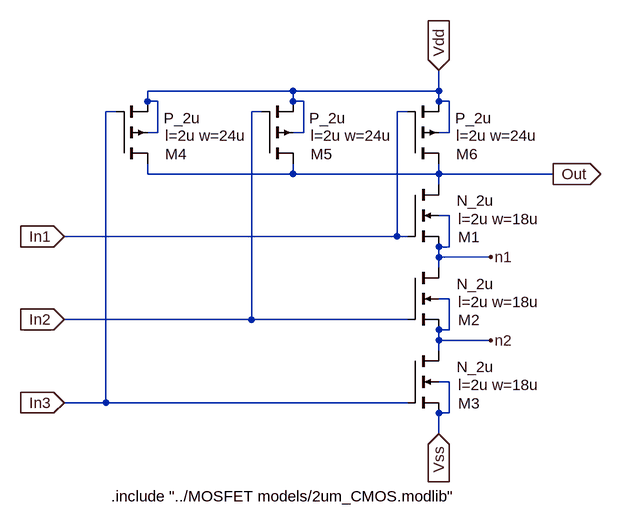
[diagram p0: schematic NAND3.asc]
NAND3.asc, the LTspice schematic file:
Version 4
SHEET 1 880 872
WIRE -32 48 -256 48
WIRE 192 48 192 16
WIRE 192 48 -32 48
WIRE -256 64 -256 48
WIRE -240 64 -256 64
WIRE -32 64 -32 48
WIRE -16 64 -32 64
WIRE 192 64 192 48
WIRE 208 64 192 64
WIRE -304 80 -320 80
WIRE -80 80 -96 80
WIRE 144 80 128 80
WIRE -240 112 -240 64
WIRE -240 112 -256 112
WIRE -16 112 -16 64
WIRE -16 112 -32 112
WIRE 208 112 208 64
WIRE 208 112 192 112
WIRE -256 176 -256 160
WIRE -32 176 -32 160
WIRE -32 176 -256 176
WIRE 192 176 192 160
WIRE 192 176 -32 176
WIRE 368 176 192 176
WIRE 192 192 192 176
WIRE 208 240 192 240
WIRE 128 272 128 80
WIRE 128 272 -384 272
WIRE 144 272 128 272
WIRE 208 288 208 240
WIRE 208 288 192 288
WIRE 192 304 192 288
WIRE 272 304 192 304
WIRE 192 320 192 304
WIRE 208 368 192 368
WIRE -96 400 -96 80
WIRE -96 400 -384 400
WIRE 144 400 -96 400
WIRE 208 416 208 368
WIRE 208 416 192 416
WIRE 192 432 192 416
WIRE 272 432 192 432
WIRE 192 448 192 432
WIRE 208 496 192 496
WIRE -320 528 -320 80
WIRE -320 528 -384 528
WIRE 144 528 -320 528
WIRE 208 544 208 496
WIRE 208 544 192 544
WIRE 192 576 192 544
FLAG 192 16 Vdd
IOPIN 192 16 In
FLAG 192 576 Vss
IOPIN 192 576 In
FLAG -384 272 In1
IOPIN -384 272 In
FLAG -384 400 In2
IOPIN -384 400 In
FLAG 368 176 Out
IOPIN 368 176 Out
FLAG -384 528 In3
IOPIN -384 528 In
FLAG 272 304 n1
FLAG 272 432 n2
SYMBOL nmos4 144 192 R0
WINDOW 0 78 81 Left 2
WINDOW 3 76 25 Left 2
WINDOW 123 78 53 Left 2
SYMATTR InstName M1
SYMATTR Value N_2u
SYMATTR Value2 l=2u w=18u
SYMBOL pmos4 144 160 M180
WINDOW 0 75 15 Left 2
WINDOW 3 73 70 Left 2
WINDOW 123 75 43 Left 2
SYMATTR InstName M6
SYMATTR Value P_2u
SYMATTR Value2 l=2u w=24u
SYMBOL pmos4 -80 160 M180
WINDOW 0 75 15 Left 2
WINDOW 3 73 70 Left 2
WINDOW 123 75 43 Left 2
SYMATTR InstName M5
SYMATTR Value P_2u
SYMATTR Value2 l=2u w=24u
SYMBOL nmos4 144 448 R0
WINDOW 0 78 81 Left 2
WINDOW 3 76 25 Left 2
WINDOW 123 78 53 Left 2
SYMATTR InstName M3
SYMATTR Value N_2u
SYMATTR Value2 l=2u w=18u
SYMBOL pmos4 -304 160 M180
WINDOW 0 75 15 Left 2
WINDOW 3 73 70 Left 2
WINDOW 123 75 43 Left 2
SYMATTR InstName M4
SYMATTR Value P_2u
SYMATTR Value2 l=2u w=24u
SYMBOL nmos4 144 320 R0
WINDOW 0 78 81 Left 2
WINDOW 3 76 25 Left 2
WINDOW 123 78 53 Left 2
SYMATTR InstName M2
SYMATTR Value N_2u
SYMATTR Value2 l=2u w=18u
TEXT -312 672 Left 2 !.include "../MOSFET models/2um_CMOS.modlib"

The netlist it stands for:
* NAND3.asc
M1 Out In1 n1 n1 N_2u l=2u w=18u
M6 Out In1 Vdd Vdd P_2u l=2u w=24u
M5 Out In2 Vdd Vdd P_2u l=2u w=24u
M3 n2 In3 Vss Vss N_2u l=2u w=18u
M4 Out In3 Vdd Vdd P_2u l=2u w=24u
M2 n1 In2 n2 n2 N_2u l=2u w=18u
.model NMOS NMOS
.model PMOS PMOS
.lib standard.mos
.include "../MOSFET models/2um_CMOS.modlib"
.backanno
.end